# EAGLE design clock_v2 (EAGLE 5.12)
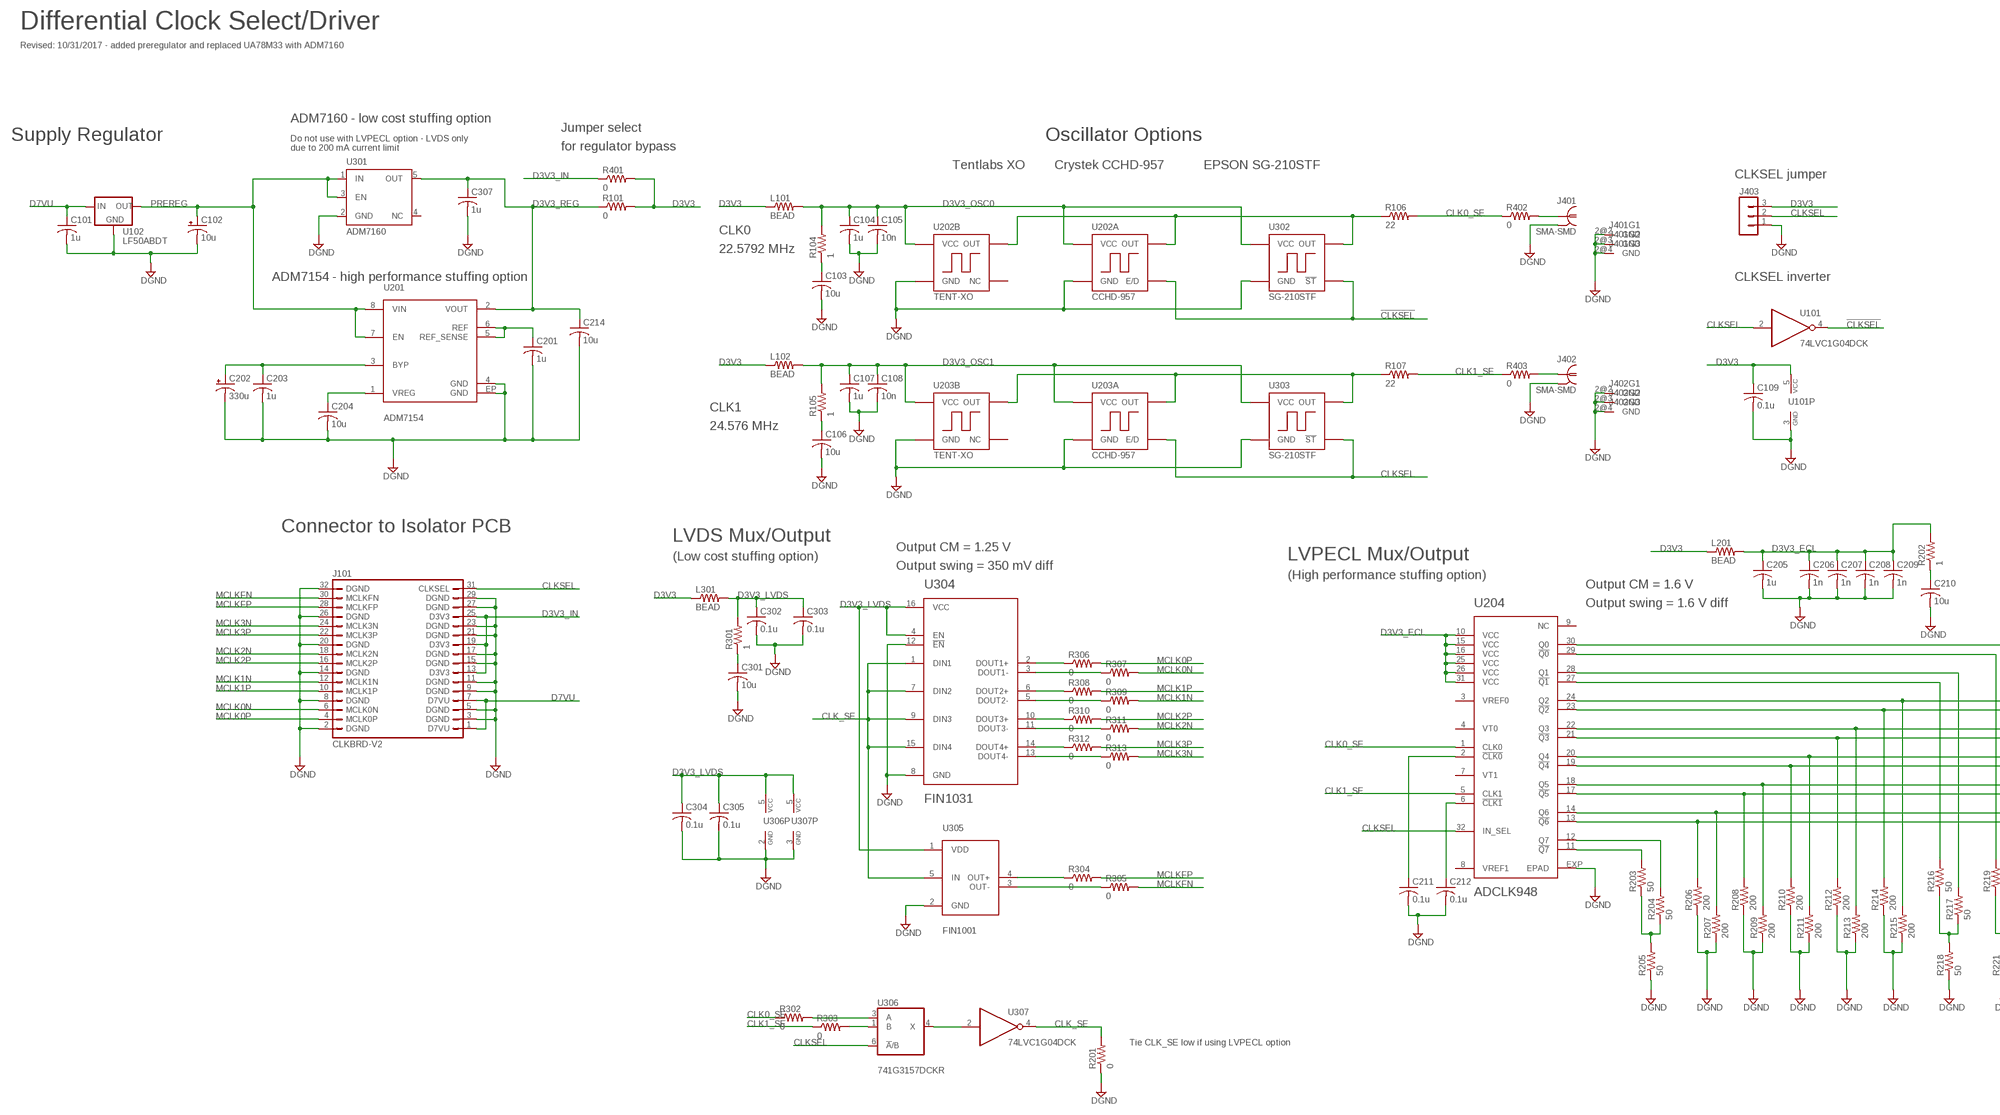
[diagram p0: schematic, sheet 1, part 1 of 2]
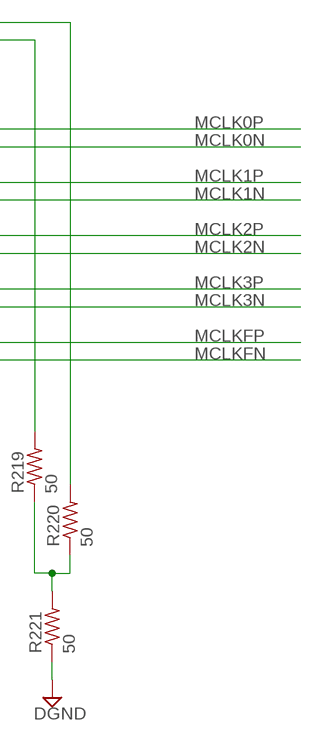
[diagram p1: schematic, sheet 1, part 2 of 2]

## Parts
C101  1u  C-USC0805  [C0805]
C102  10u  CPOL-USB  [PANASONIC_B]
C103  10u  C-USC1206  [C1206]
C104  1u  C-USC1206  [C1206]
C105  10n  C-USC0402  [C0402]
C106  10u  C-USC1206  [C1206]
C107  1u  C-USC1206  [C1206]
C108  10n  C-USC0402  [C0402]
C109  0.1u  C-USC0603  [C0603]
C201  1u  C-USC0805  [C0805]
C202  330u  CPOL-USCT7343  [CT7343]
C203  1u  C-USC0805  [C0805]
C204  10u  C-USC1206  [C1206]
C205  1u  C-USC1206  [C1206]
C206  1n  C-USC0402  [C0402]
C207  1n  C-USC0402  [C0402]
C208  1n  C-USC0402  [C0402]
C209  1n  C-USC0402  [C0402]
C210  10u  C-USC1206  [C1206]
C211  0.1u  C-USC0603  [C0603]
C212  0.1u  C-USC0603  [C0603]
C214  10u  C-USC1206  [C1206]
C301  10u  C-USC1206  [C1206]
C302  0.1u  C-USC0603  [C0603]
C303  0.1u  C-USC0603  [C0603]
C304  0.1u  C-USC0603  [C0603]
C305  0.1u  C-USC0603  [C0603]
C307  1u  C-USC0603  [C0603]
J101  CLKBRD-V2  [MA16-2]
J401  SMA-SMD  [SMA-SMD]
J402  SMA-SMD  [SMA-SMD]
J403  MA03-1  [MA03-1]
L101  BEAD  R-US_R1206  [R1206]
L102  BEAD  R-US_R1206  [R1206]
L201  BEAD  R-US_R1206  [R1206]
L301  BEAD  R-US_R1206  [R1206]
R101  0  R-US_R1206  [R1206]
R104  1  R-US_R1206  [R1206]
R105  1  R-US_R1206  [R1206]
R106  22  R-US_R0603  [R0603]
R107  22  R-US_R0603  [R0603]
R201  0  R-US_R0603  [R0603]
R202  1  R-US_R1206  [R1206]
R203  50  R-US_R0603  [R0603]
R204  50  R-US_R0603  [R0603]
R205  50  R-US_R0603  [R0603]
R206  200  R-US_R0603  [R0603]
R207  200  R-US_R0603  [R0603]
R208  200  R-US_R0603  [R0603]
R209  200  R-US_R0603  [R0603]
R210  200  R-US_R0603  [R0603]
R211  200  R-US_R0603  [R0603]
R212  200  R-US_R0603  [R0603]
R213  200  R-US_R0603  [R0603]
R214  200  R-US_R0603  [R0603]
R215  200  R-US_R0603  [R0603]
R216  50  R-US_R0603  [R0603]
R217  50  R-US_R0603  [R0603]
R218  50  R-US_R0603  [R0603]
R219  50  R-US_R0603  [R0603]
R220  50  R-US_R0603  [R0603]
R221  50  R-US_R0603  [R0603]
R301  1  R-US_R1206  [R1206]
R302  0  R-US_R0603  [R0603]
R303  0  R-US_R0603  [R0603]
R304  0  R-US_R0603  [R0603]
R305  0  R-US_R0603  [R0603]
R306  0  R-US_R0603  [R0603]
R307  0  R-US_R0603  [R0603]
R308  0  R-US_R0603  [R0603]
R309  0  R-US_R0603  [R0603]
R310  0  R-US_R0603  [R0603]
R311  0  R-US_R0603  [R0603]
R312  0  R-US_R0603  [R0603]
R313  0  R-US_R0603  [R0603]
R401  0  R-US_R1206  [R1206]
R402  0  R-US_R0603  [R0603]
R403  0  R-US_R0603  [R0603]
U101  74LVC1G04DCK  [SC70-5]
U102  LF50ABDT  78XXS  [DPACK]
U201  ADM7154  [SO8-EP]
U202A  CCHD-957  [CCHD-957]
U202B  TENT-XO  [DIP4-XO]
U203A  CCHD-957  [CCHD-957]
U203B  TENT-XO  [DIP4-XO]
U204  ADCLK948  [LFCSP32]
U301  ADM7160  [SOT23-DBV]
U302  SG-210STF  [SG-210STF]
U303  SG-210STF  [SG-210STF]
U304  FIN1031  [TSSOP16]
U305  FIN1001  [SOT23-DBV]
U306  741G3157DCKR  [DCK_R-PDSO-G6]
U307  74LVC1G04DCK  [SC70-5]

## Nets
!CLKSEL: U101.4(O) U202A.1(E/D) U302.1(!ST)
CLK0_SE: R106.2 R302.1 R402.1 U204.1(CLK0)
CLK1_SE: R107.2 R303.1 R403.1 U204.5(CLK1)
CLK_SE: R201.2 U304.1(DIN1) U304.7(DIN2) U304.9(DIN3) U304.15(DIN4) U305.5(IN) U307.4(O)
CLKSEL: J101.31(CLKSEL) J403.2 U101.2(I) U203A.1(E/D) U204.32(IN_SEL) U303.1(!ST) U306.6(!A!/B)
D3V3: C109.1 J403.3 L101.1 L102.1 L201.1 L301.1 R101.2 R401.2 U101.5(VCC)
D3V3_ECL: C205.1 C206.1 C207.1 C208.1 C209.1 L201.2 R202.2 U204.10(VCC) U204.15(VCC) U204.16(VCC) U204.25(VCC) U204.26(VCC) U204.31(VCC)
D3V3_IN: J101.13(D3V3) J101.19(D3V3) J101.25(D3V3) R401.1
D3V3_LVDS: C302.1 C303.1 C304.1 C305.1 L301.2 R301.2 U304.4(EN) U304.16(VCC) U305.1(VDD) U306.5(VCC) U307.5(VCC)
D3V3_OSC0: C104.1 C105.1 L101.2 R104.2 U202A.4(VCC) U202B.8(VCC) U302.4(VCC)
D3V3_OSC1: C107.1 C108.1 L102.2 R105.2 U203A.4(VCC) U203B.8(VCC) U303.4(VCC)
D3V3_REG: C214.1 C307.1 R101.1 U201.2(VOUT) U301.5(OUT)
D7VU: C101.1 J101.1(D7VU) J101.7(D7VU) U102.1(IN)
DGND: C101.2 C102.- C103.2 C104.2 C105.2 C106.2 C107.2 C108.2 C109.2 C201.2 C202.- C203.2 C204.2 C205.2 C206.2 C207.2 C208.2 C209.2 C210.2 C211.2 C212.2 C214.2 C301.2 C302.2 C303.2 C304.2 C305.2 C307.2 J101.2(DGND) J101.3(DGND) J101.5(DGND) J101.8(DGND) J101.9(DGND) J101.11(DGND) J101.14(DGND) J101.15(DGND) J101.17(DGND) J101.20(DGND) J101.21(DGND) J101.23(DGND) J101.26(DGND) J101.27(DGND) J101.29(DGND) J101.32(DGND) J401.2@1(GND) J401.2@2(GND) J401.2@3(GND) J401.2@4(GND) J402.2@1(GND) J402.2@2(GND) J402.2@3(GND) J402.2@4(GND) J403.1 R201.1 R205.1 R206.1 R207.1 R208.1 R209.1 R210.1 R211.1 R212.1 R213.1 R214.1 R215.1 R218.1 R221.1 U101.3(GND) U102.4(GND) U201.4(GND) U201.EP(GND) U202A.2(GND) U202B.4(GND) U203A.2(GND) U203B.4(GND) U204.EXP(EPAD) U301.2(GND) U302.2(GND) U303.2(GND) U304.8(GND) U304.12(!EN) U305.2(GND) U306.2(GND) U307.3(GND)
MCLK0N: J101.6(MCLK0N) R214.2 R307.2 U204.23(!Q2)
MCLK0P: J101.4(MCLK0P) R215.2 R306.2 U204.24(Q2)
MCLK1N: J101.12(MCLK1N) R212.2 R309.2 U204.21(!Q3)
MCLK1P: J101.10(MCLK1P) R213.2 R308.2 U204.22(Q3)
MCLK2N: J101.18(MCLK2N) R210.2 R311.2 U204.19(!Q4)
MCLK2P: J101.16(MCLK2P) R211.2 R310.2 U204.20(Q4)
MCLK3N: J101.24(MCLK3N) R208.2 R313.2 U204.17(!Q5)
MCLK3P: J101.22(MCLK3P) R209.2 R312.2 U204.18(Q5)
MCLKFN: J101.30(MCLKFN) R206.2 R305.2 U204.13(!Q6)
MCLKFP: J101.28(MCLKFP) R207.2 R304.2 U204.14(Q6)
N$1: C204.1 U201.1(VREG)
N$2: R106.1 U202A.3(OUT) U202B.5(OUT) U302.3(OUT)
N$3: C202.+ C203.1 U201.3(BYP)
N$4: C201.1 U201.5(REF_SENSE) U201.6(REF)
N$5: J401.1 R402.2
N$6: J402.1 R403.2
N$7: R107.1 U203A.3(OUT) U203B.5(OUT) U303.3(OUT)
N$8: R203.2 U204.11(!Q7)
N$9: C212.1 U204.6(!CLK1)
N$10: C211.1 U204.2(!CLK0)
N$11: R204.2 U204.12(Q7)
N$14: R306.1 U304.2(DOUT1+)
N$15: R302.2 U306.3(A)
N$16: R303.2 U306.1(B)
N$17: R307.1 U304.3(DOUT1-)
N$18: U306.4(X) U307.2(I)
N$19: C103.1 R104.1
N$20: R308.1 U304.6(DOUT2+)
N$21: R309.1 U304.5(DOUT2-)
N$22: R216.2 U204.27(!Q1)
N$23: R217.2 U204.28(Q1)
N$24: R219.2 U204.29(!Q0)
N$25: R220.2 U204.30(Q0)
N$26: R203.1 R204.1 R205.2
N$27: C106.1 R105.1
N$28: C301.1 R301.1
N$29: R216.1 R217.1 R218.2
N$30: R219.1 R220.1 R221.2
N$31: R310.1 U304.10(DOUT3+)
N$32: C210.1 R202.1
N$33: R311.1 U304.11(DOUT3-)
N$35: R312.1 U304.14(DOUT4+)
N$37: R313.1 U304.13(DOUT4-)
N$39: R304.1 U305.4(OUT+)
N$41: R305.1 U305.3(OUT-)
PREREG: C102.+ U102.3(OUT) U201.7(EN) U201.8(VIN) U301.1(IN) U301.3(EN)
Unconnected: U202B.1(NC) U203B.1(NC) U204.3(VREF0) U204.4(VT0) U204.7(VT1) U204.8(VREF1) U204.9(NC) U301.4(NC)

## Notes on the sheet
- Differential Clock Select/Driver
- Revised: 10/31/2017 - added preregulator and replaced UA78M33 with ADM7160
- ADM7160 - low cost stuffing option
- Jumper select
- Supply Regulator | Do not use with LVPECL option - LVDS only | Oscillator Options
- due to 200 mA current limit | for regulator bypass
- Tentlabs XO | Crystek CCHD-957 | EPSON SG-210STF
- CLKSEL jumper
- CLK0
- 22.5792 MHz
- ADM7154 - high performance stuffing option | CLKSEL inverter
- CLK1
- 24.576 MHz
- Connector to Isolator PCB
- LVDS Mux/Output
- Output CM = 1.25 V
- (Low cost stuffing option) | LVPECL Mux/Output
- Output swing = 350 mV diff
- (High performance stuffing option)
- Output CM = 1.6 V
- Output swing = 1.6 V diff
- Tie CLK_SE low if using LVPECL option

## Library data of the parts
C101 C103-C109 C201 C203-C212 C214 C301-C305 C307 = rcl:C-US: CAPACITOR, American symbol
C102 C202 = rcl:CPOL-US: POLARIZED CAPACITOR, American symbol
J101 = cdp:CLKBRD-V2
J401 J402 = cdp:SMA-SMD: SMA 50 Ohm Straight Jack Receptacle - Surface Mount www.johnsoncomponents.com Source: http://catalog.digikey.com .. 142-0711-201, 205, 202, 206.pdf; OC_FARNELL: unknown; OC_NEWARK: unknown
J403 = con-lstb:MA03-1: PIN HEADER; OC_FARNELL: unknown; OC_NEWARK: unknown
L101 L102 L201 L301 R101 R104-R107 R201-R221 R301-R313 R401-R403 = rcl:R-US_: RESISTOR, American symbol
U101 U307 = 74xx-little-us:74*1G04: INVERTER Gate
U102 = cdp:78XXS: VOLTAGE REGULATOR
U201 = cdp:ADM7154
U202A U203A = cdp:CCHD-957
U202B U203B = cdp:TENT-XO
U204 = cdp:ADCLK948
U301 = cdp:ADM7160
U302 U303 = cdp:SG-210STF
U304 = cdp:FIN1031
U305 = cdp:FIN1001
U306 = 74xx-little-us:74*1G3157: Single-Pole, Double-Throw Analog Switch Source: http://focus.ti.com/lit/ds/symlink/sn74lvc1g3157.pdf

## Board
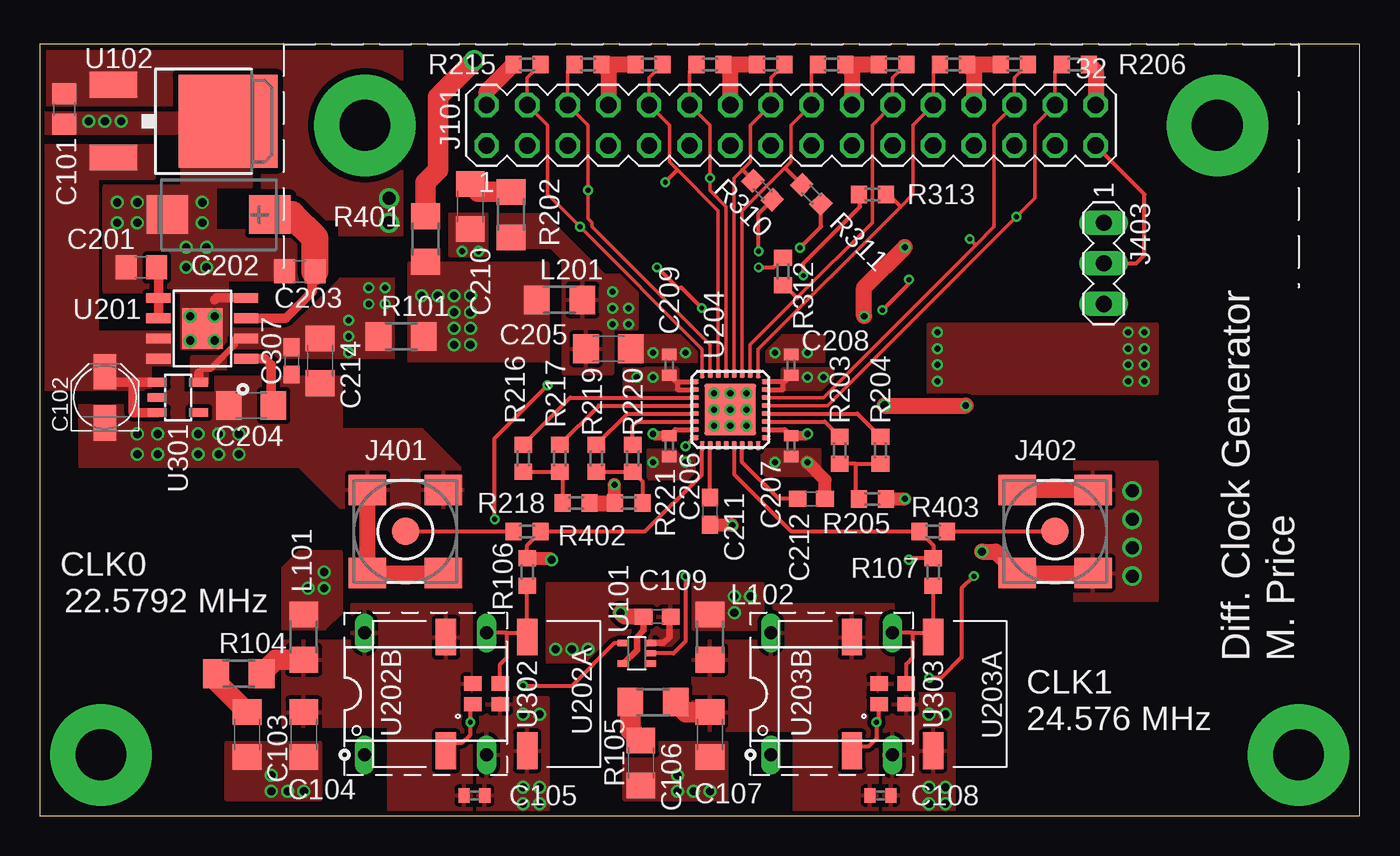
[diagram p2: board, top side]
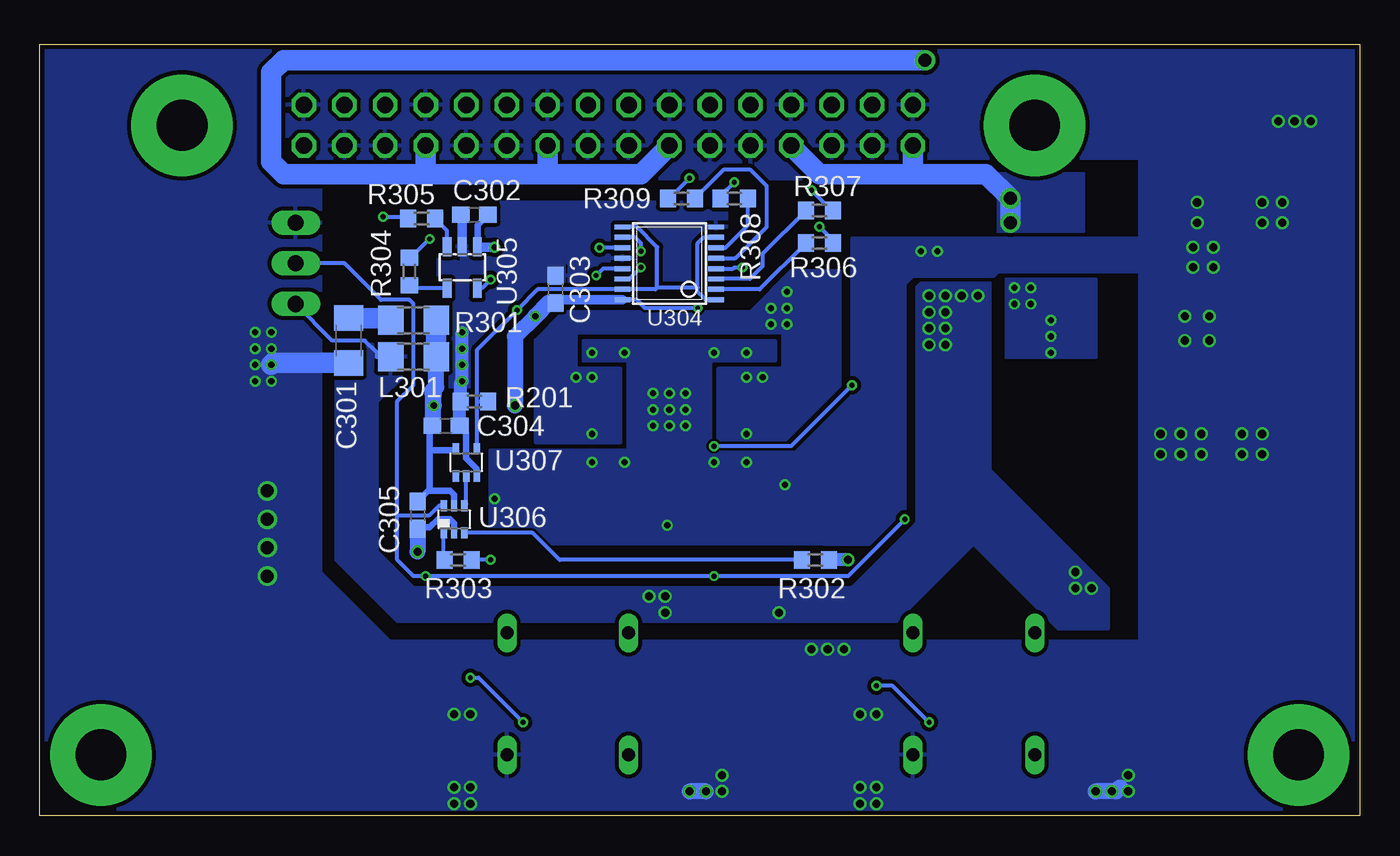
[diagram p3: board, bottom side, seen from below]

Size 82.55 x 48.26 mm. Coordinates in mm from the lower left corner, seen from the top.
Outline: 0,0 82.55,0 82.55,48.26 0,48.26 0,0
Copper layers (1*16): Top 0.035mm / dielectric 1.6mm / Bottom 0.035mm
Design rules "Elecrow_2-layer_PCB_eagle_rule_mod": minimum track width 6mil, minimum drill 12mil, track to track 6mil, track to pad 6mil, pad to pad 6mil, via to via 8mil, smd to smd 0mil, copper to edge 12mil, drill to drill 10mil, minimum pad ring 6mil, minimum via ring 6mil, stop-mask expansion 0mil, vias tented up to drill 100mil, thermal gap 10mil

### Footprints (pad centres in the part's own frame; a part is rotated, then mirrored left to right if it is on the bottom)
C0805 = smd 1.3 x 1.5: 1 -0.95,0; 2 0.95,0
PANASONIC_B = smd 2.2 x 1.4: + 1.6,0; - -1.6,0
C1206 = smd 1.6 x 1.8: 1 -1.4,0; 2 1.4,0
C0402 = smd 0.7 x 0.9: 1 -0.65,0; 2 0.65,0
C0603 = smd 1.1 x 1: 1 -0.85,0; 2 0.85,0
CT7343 = smd 2.6 x 2.4: + -3.2,0; - 3.2,0
MA16-2 = drill 1.016 octagon: 1 -20.32,-1.27; 2 -20.32,1.27; 3 -17.78,-1.27; 4 -17.78,1.27; 5 -15.24,-1.27; 6 -15.24,1.27; 7 -12.7,-1.27; 8 -12.7,1.27; 9 -10.16,-1.27; 10 -10.16,1.27; 11 -7.62,-1.27; 12 -7.62,1.27; 13 -5.08,-1.27; 14 -5.08,1.27; 15 -2.54,-1.27; 16 -2.54,1.27; 17 0,-1.27; 18 0,1.27; 19 2.54,-1.27; 20 2.54,1.27; 21 5.08,-1.27; 22 5.08,1.27; 23 7.62,-1.27; 24 7.62,1.27; 25 10.16,-1.27; 26 10.16,1.27; 27 12.7,-1.27; 28 12.7,1.27; 29 15.24,-1.27; 30 15.24,1.27; 31 17.78,-1.27; 32 17.78,1.27 | drill 3.175 pad 6.35 round: P$1 25.4,0; P$2 -27.94,0
SMA-SMD = smd 1.73 x 1.73: 1 0,0 | smd 2.35 x 1.9: 2@1 -2.375,2.6; 2@2 -2.375,-2.6; 2@3 2.375,-2.6; 2@4 2.375,2.6
MA03-1 = drill 1.016 long: 1 -2.54,0; 2 0,0; 3 2.54,0
R1206 = smd 1.6 x 1.803: 1 -1.422,0; 2 1.422,0
R0603 = smd 1 x 1.1: 1 -0.85,0; 2 0.85,0
SC70-5 = smd 0.4 x 0.7: 1 -0.65,-0.85; 2 0,-0.85; 3 0.65,-0.85; 4 0.65,0.85; 5 -0.65,0.85
DPACK = smd 1.6 x 3: 1 -2.28,-4.8; 3 2.28,-4.8 | smd 5.8 x 6.2: 4 0,2.38
SO8-EP = smd 0.61 x 1.524: 1 -1.905,-2.743; 2 -0.635,-2.743; 3 0.635,-2.743; 4 1.905,-2.743; 5 1.905,2.743; 6 0.635,2.743; 7 -0.635,2.743; 8 -1.905,2.743 | smd 2.54 x 2.54: EP 0,0
CCHD-957 = smd 1.27 x 2.286: 1 -2.54,-3.556; 2 2.54,-3.556; 3 2.54,3.556; 4 -2.54,3.556
DIP4-XO = drill 0.813 long: 1 -3.81,-3.81; 4 3.81,-3.81; 5 3.81,3.81; 8 -3.81,3.81
LFCSP32 = smd 0.55 x 0.3: 1 -2.25,1.75; 2 -2.25,1.25; 3 -2.25,0.75; 4 -2.25,0.25; 5 -2.25,-0.25; 6 -2.25,-0.75; 7 -2.25,-1.25; 8 -2.25,-1.75; 17 2.25,-1.75; 18 2.25,-1.25; 19 2.25,-0.75; 20 2.25,-0.25; 21 2.25,0.25; 22 2.25,0.75; 23 2.25,1.25; 24 2.25,1.75 | smd 0.3 x 0.55: 9 -1.75,-2.25; 10 -1.25,-2.25; 11 -0.75,-2.25; 12 -0.25,-2.25; 13 0.25,-2.25; 14 0.75,-2.25; 15 1.25,-2.25; 16 1.75,-2.25; 25 1.75,2.25; 26 1.25,2.25; 27 0.75,2.25; 28 0.25,2.25; 29 -0.25,2.25; 30 -0.75,2.25; 31 -1.25,2.25; 32 -1.75,2.25 | smd 3.25 x 3.25: EXP 0,0
SOT23-DBV = smd 0.55 x 1.2: 1 -0.95,-1.3; 2 0,-1.3; 3 0.95,-1.3; 4 0.95,1.3; 5 -0.95,1.3
SG-210STF = smd 1.1 x 0.9: 1 -0.85,-0.65; 2 0.85,-0.65; 3 0.85,0.65; 4 -0.85,0.65
TSSOP16 = smd 0.305 x 0.991: 1 -2.275,-2.918; 2 -1.625,-2.918; 3 -0.975,-2.918; 4 -0.325,-2.918; 5 0.325,-2.918; 6 0.975,-2.918; 7 1.625,-2.918; 8 2.275,-2.918; 9 2.275,2.918; 10 1.625,2.918; 11 0.975,2.918; 12 0.325,2.918; 13 -0.325,2.918; 14 -0.975,2.918; 15 -1.625,2.918; 16 -2.275,2.918
DCK_R-PDSO-G6 = smd 0.4 x 0.7: 1 -0.65,-0.85; 2 0,-0.85; 3 0.65,-0.85; 4 0.65,0.85; 5 0,0.85; 6 -0.65,0.85

### Placement (x,y rotation side)
C101  1.52,44.2 270 top
C102  4.06,26.16 90 top
C103  12.95,5.08 270 top
C104  16.51,5.08 270 top
C105  27.18,1.27 0 top
C106  37.59,3.3 270 top
C107  41.91,5.08 270 top
C108  52.58,1.27 0 top
C109  38.61,12.45 0 top
C201  6.35,34.29 180 top
C202  11.18,37.59 180 top
C203  16.26,34.04 180 top
C204  13.21,25.65 180 top
C205  35.56,29.21 0 top
C206  39.37,23.11 270 top
C207  46.99,23.11 270 top
C208  46.99,28.19 90 top
C209  39.37,28.19 90 top
C210  26.92,38.1 270 top
C211  41.91,19.05 270 top
C212  48.26,19.81 0 top
C214  17.53,28.45 270 top
C301  63.25,29.72 270 bottom
C302  55.37,37.59 180 bottom
C303  50.29,32.92 90 bottom
C304  57.15,24.38 0 bottom
C305  58.93,18.8 270 bottom
C307  15.75,28.45 270 top
J101  48.26,43.18 0 top
J401  22.86,17.78 0 top
J402  63.5,17.78 0 top
J403  66.55,34.54 270 top
L101  16.51,11.18 270 top
L102  41.91,11.18 270 top
L201  32.51,32.26 0 top
L301  59.18,28.7 0 bottom
R101  22.61,29.97 0 top
R104  12.45,8.89 0 top
R105  38.35,7.11 0 top
R106  30.48,15.24 90 top
R107  55.88,15.24 90 top
R201  55.37,25.91 0 bottom
R202  29.46,37.59 270 top
R203  50.04,22.86 90 top
R204  52.58,22.86 90 top
R205  52.07,19.81 180 top
R206  64.77,46.99 180 top
R207  60.96,46.99 0 top
R208  57.15,46.99 180 top
R209  53.34,46.99 0 top
R210  49.53,46.99 180 top
R211  45.72,46.99 0 top
R212  41.91,46.99 180 top
R213  38.1,46.99 0 top
R214  34.29,46.99 180 top
R215  30.48,46.99 0 top
R216  30.23,22.35 90 top
R217  32.51,22.35 90 top
R218  33.53,19.56 180 top
R219  34.8,22.35 90 top
R220  37.08,22.35 90 top
R221  36.83,19.56 0 top
R301  59.18,30.99 0 bottom
R302  34.04,16 180 bottom
R303  56.39,16 180 bottom
R304  59.44,34.04 90 bottom
R305  58.67,37.34 180 bottom
R306  33.78,35.81 0 bottom
R307  33.78,37.85 0 bottom
R308  39.12,38.61 180 bottom
R309  42.42,38.61 180 bottom
R310  45.21,39.12 135 top
R311  48.26,38.86 135 top
R312  46.48,34.04 270 top
R313  52.07,38.86 0 top
R401  24.13,36.07 270 top
R402  30.48,17.78 180 top
R403  55.88,17.78 0 top
U101  37.34,10.16 90 top
U102  9.4,43.43 270 top
U201  10.16,30.48 90 top
U202A  27.94,7.62 0 top
U202B  24.13,7.62 0 top
U203A  53.34,7.62 0 top
U203B  49.53,7.62 0 top
U204  43.18,25.4 90 top
U301  8.64,26.16 270 top
U302  27.94,7.62 0 top
U303  53.34,7.62 0 top
U304  43.18,34.54 90 bottom
U305  56.13,34.29 180 bottom
U306  56.64,18.54 0 bottom
U307  55.88,22.1 0 bottom

### Tracks (layer width: path | path; a pad name or v marks a point on that pad's centre or on a via)
!CLKSEL  (via drill 0.3 pad 0.51)
  Top 0.254: U101.4 35.96,10.81 33.27,8.13 v30.23,8.13 | U302.1 26.92,6.8 v26.92,5.84 26.92,5.08 26.42,4.57 25.4,4.57 U202A.1
  Bottom 0.254: v30.23,8.13 29.21,8.13 v26.92,5.84
CLK0_SE  (via drill 0.51 pad 0.81)
  Top 0.254: R106.2 30.48,16.93 R402.1 37.85,17.78 41.4,21.34 41.4,23.12 U204.1
  Top 0.813: R106.2 31.92,16.09 v32,16
  Bottom 0.813: v32,16 R302.1
CLK1_SE  (via drill 0.3 pad 0.51)
  Top 0.254: U204.5 43.43,21.34 46.99,17.78 R403.1 55.88,16.93 R107.2 54.44,16.09 v54.36,16
  Bottom 0.254: v54.36,16 R303.1
CLK_SE  (via drill 0.3 pad 0.51)
  Top 0.254: v54.36,33.53 54.36,33.27 v52.7,31.62
  Bottom 0.254: 43.94,33.02 43.94,35.56 45.2,36.82 U304.9 | 43.94,33.02 44.04,32.92 U304.15 51.41,32.92 v52.7,31.62 55.23,29.1 55.23,25.91 | U304.7 41.05,36.17 41.4,35.81 41.4,33.02 | 41.4,33.02 43.94,33.02 | 55.23,25.91 U307.4 | 40.66,32.26 40.65,32.27 | 40.66,32.26 40.89,32.26 41.4,32.77 41.4,33.02 | 55.23,25.91 R201.2 | 40.66,32.26 40.27,32.26 U304.1 | U305.5 54.89,32.99 v54.36,33.53
CLKSEL  (via drill 0.3 pad 0.51)
  Top 0.254: U204.32 v40.39,23.11 | v58.42,14.99 57.66,14.22 57.66,9.91 56.39,8.64 v55.63,8.64 | U303.1 52.49,6.01 v52.32,5.84 52.32,4.83 51.82,4.32 51.05,4.32 U203A.1 | v40.39,14.99 40.39,10.92 39.62,10.16 U101.2 | v28.45,18.54 28.45,23.62 v31.75,26.92 | J101.31 69.09,38.86 69.09,35.05 68.58,34.54 J403.2
  Bottom 0.254: v40.39,23.11 35.56,23.11 v31.75,26.92 | 60.2,18.8 60.2,16 59.18,14.99 v58.42,14.99 v40.39,14.99 32,14.99 v28.45,18.54 | 60.2,18.8 60.2,25.91 59.18,26.92 59.18,32 59.44,32.26 61.21,32.26 63.5,34.54 J403.2 | v55.63,8.64 55.12,8.64 v52.32,5.84 | U306.6 57.57,19.39 58.17,18.8 60.2,18.8
D3V3  (via drill 0.51 pad 0.81)
  Top 0.406: U101.5 37.34,10.36 37.34,11.18 37.76,11.6 C109.1
  Top 0.813: L101.1 16.76,12.85
  Top 1.016: C109.1 36.58,12.45 v36.32,12.7
  Top 1.27: R401.2 24.03,34.54
  Bottom 0.254: L301.1 61.47,28.7 61.47,28.96 62.23,29.72 64.26,29.72 J403.3
  other vias: 23.88,32.51 24.89,32.51 25.91,32.51 26.92,32.51 25.91,31.5 26.92,31.5 26.92,30.48 25.91,30.48 25.91,29.46 26.92,29.46 16.76,14.22 17.78,14.22 17.78,15.24 43.43,13.72 44.45,13.72 43.43,12.7
  pour Top (isolate 0.254, no thermals): 23.11,28.45 23.11,34.54 31.75,34.54 31.75,28.45
  pour Bottom (isolate 0.254): 23.11,33.27 27.43,33.27 27.69,33.02 27.69,18.29 31.75,14.22 59.18,14.22 61.47,16.51 61.47,25.91 59.69,27.69 59.69,29.46 61.98,29.46 64.01,27.43 64.01,16 60.2,12.19 28.96,12.19 23.11,18.03
  pour Bottom (isolate 0.254): 15.75,11.68 18.8,11.68 24.13,17.02 24.38,22.86 15.75,14.22
  pour Top (isolate 0.254, no thermals): 15.24,11.68 15.24,15.49 16.26,16.51 18.8,16.51 18.8,12.7 17.78,11.68
  pour Top (isolate 0.254, no thermals): 40.89,14.48 40.89,11.68 45.21,11.68 45.21,14.48
D3V3_ECL  (via drill 0.38 pad 0.64)
  Top 0.305: U204.10 46.6,24.15 C207.1 | U204.31 39.76,24.15 C206.1 | 39.88,27.15 39.76,27.15 C209.1 | 39.88,27.15 U204.25 | 46.48,27.15 U204.16 | 46.48,27.15 46.6,27.15 C208.1 | U204.15 46.48,26.65 46.48,27.15 | U204.26 39.88,26.65 39.88,27.15
  Top 0.61: C207.1 47.89,23.76 v48.01,23.88 | C206.1 38.47,23.76 v38.35,23.88
  other vias: 48.01,27.43 49.02,27.43 38.35,27.43 37.34,27.43 35.81,32.77 35.81,31.75 36.83,31.75 35.81,30.73 36.83,30.73
  pour Bottom: 36.07,27.94 40.13,27.94 40.13,23.37 36.07,23.37 32.51,26.92 32.51,34.04 35.56,34.04 38.1,31.5 49.78,31.5 51.56,29.72 51.56,23.37 46.23,23.37 46.23,27.94 49.02,27.94 49.02,30.23 36.07,30.23
  pour Top: 35.81,28.45 35.81,30.48 37.34,30.48 37.34,33.78 32.77,33.78 32.77,27.69 35.81,27.69
  pour Top (isolate 0.254, no thermals): 39.88,26.67 39.88,27.94 36.58,27.94 36.58,26.67
  pour Top (isolate 0.254, no thermals): 46.48,27.94 49.53,27.94 49.53,26.67 46.48,26.67
  pour Top (isolate 0.254, no thermals): 31.5,37.59 35.31,33.78 32.77,33.78 32.77,34.8 32,35.56 28.7,35.56 28.7,37.59
D3V3_IN  (via drill 0.81 pad 1.27)
  Top 1.27: v27.18,47.24 24.89,44.96 24.89,40.39 24.13,39.62 R401.1
  Bottom 0.254: 58.17,40.13 58.42,40.39
  Bottom 1.27: J101.13 44.96,40.13 51.05,40.13 | J101.19 50.8,40.39 51.05,40.13 | 51.05,40.13 58.17,40.13 67.31,40.13 68.07,40.89 68.07,46.48 67.31,47.24 v27.18,47.24 | 58.42,40.39 J101.25
D3V3_LVDS  (via drill 0.3 pad 0.51, 0.38 pad 0.64, 0.51 pad 0.81)
  Top 0.254: v41.4,31.75 40.13,33.02 39.88,33.02 v38.61,34.29
  Top 1.016: v51.56,31.24 51.56,33.02 v54.1,35.56 | v52.83,25.65 v57.91,25.65
  Bottom 0.254: U304.4 39.19,34.22 39.12,34.29 v38.61,34.29 | v41.4,31.75 44.7,31.75 45.21,32.26 46.09,32.26 U304.16 | 50.07,32.27 50.27,32.07 C303.1 50.74,32.07
  Bottom 0.406: C305.1 58.25,20.32 58.17,20.32 | 58.17,20.32 56.9,20.32 56.64,20.07 U306.5 | C304.1 58.17,24.22 58.17,22.86 | 58.17,22.86 58.17,20.32 | U307.5 56.62,22.86 58.17,22.86 | U305.1 55.18,36.93 C302.1
  Bottom 0.61: U304.16 50.07,32.27 | v54.1,35.56 54.9,35.56 U305.1
  Bottom 1.016: 58,26.42 C304.1 | 58,26.42 58,26.58 57.76,26.82 L301.2 | 50.74,32.07 v51.56,31.24 52.83,29.97 v52.83,25.65 | v57.91,25.65 57.91,26.33 58,26.42
  Bottom 1.27: L301.2 R301.2
D3V3_OSC0
  Top 1.27: L101.2 14.73,9.75 R104.2
  pour Top (isolate 0.254): 15.24,10.92 19.56,10.92 19.56,13.21 26.92,13.21 26.92,0.25 21.84,0.25 21.84,5.59 15.24,5.59
D3V3_OSC1
  Top 1.27: C107.1 40.41,6.48 R105.2
  pour Top (isolate 0.254): 40.89,10.92 45.72,10.92 45.97,10.92 45.97,13.21 53.34,13.21 53.34,8.13 52.32,8.13 52.32,0.25 47.24,0.25 47.24,5.33 40.89,5.33
D3V3_REG  (via drill 0.38 pad 0.64)
  Top 0.406: U201.2 12.19,29.84 12.19,29.46 10.67,27.94 10.19,27.94 9.94,27.69
  Top 0.61: U301.5 9.94,27.69
  other vias: 20.57,33.02 21.59,33.02 21.59,32 20.57,32 19.3,30.99 19.3,29.97 19.3,28.96
  pour Top (isolate 0.254, no thermals): 12.19,31.24 12.19,28.7 22.1,28.7 22.1,33.53 18.8,33.53 16.51,31.24
  pour Bottom (isolate 0.254): 17.78,33.53 22.1,33.53 22.1,28.7 16.51,28.7 16.51,33.53
  pour Top (isolate 0.254, no thermals): 9.53,27.05 9.53,28.7 11.56,28.7 11.56,27.94 10.41,27.94 10.41,27.05
D7VU  (via drill 0.81 pad 1.27)
  Bottom 1.27: J101.7 33.78,40.13 28.19,40.13 | 28.19,40.13 23.37,40.13 v21.84,38.61 v21.84,37.08 | J101.1 27.94,40.39 28.19,40.13
  pour Top (isolate 0.381, no thermals): 13.97,44.45 0,44.45 0,48.26 22.61,48.26 22.61,36.32 18.8,36.32 18.8,37.34 13.97,37.34
  pour Bottom (isolate 0.254): 17.27,40.13 22.61,40.13 22.61,36.58 17.27,36.58
DGND  (via drill 0.38 pad 0.64, 0.51 pad 0.51, 0.51 pad 0.81, 0.81 pad 0.64)
  Top 0.406: U101.3 39,10.81 39.37,11.18 39.37,12.36 C109.2
  Top 0.61: U201.4 11.05,32.38 10.92,32.26
  Top 0.813: v35.94,20.7 35.94,19.6 R221.1 | v48.01,22.1 49.11,20.99 C212.2 49.11,19.72 | C211.2 43.27,18.2 v43.31,18.16 | R205.1 v54.1,19.81
  Top 1.016: J101.2 27.94,45.3 R215.1 | J101.8 35.56,46.57 R214.1 R213.1 | R212.1 43.43,46.99 | 43.43,46.99 R211.1 | J101.14 43.18,46.74 43.43,46.99 | R209.1 R210.1 50.8,46.57 J101.20 | R207.1 R208.1 58.42,46.57 J101.26 | J101.32 66.04,46.57 R206.1 | R218.1 R221.1 | J401.2@1 J401.2@2 J401.2@3 | J402.2@1 J402.2@4 | J402.2@3 J402.2@2 59.8,16.51 v58.93,16.51
  Bottom 0.406: U307.3 55.23,21.7 55.88,22.35 55.88,23.96 C304.2 | U306.2 56.64,18.29 56.9,18.54 57.66,18.54 58.17,18.03 58.84,18.03 C305.2 | C302.2 56.13,37.5
  Bottom 0.61: 56.13,37.5 U305.2
  Bottom 0.813: C304.2 56.3,25.83 R201.1 56.22,27.09 v56.13,27.18 v56.13,28.19 v56.13,29.21 v56.13,30.23
  Bottom 1.016: C303.2 50.31,33.78 | v40.89,1.52 v41.91,1.52 | v16.51,1.52 15.24,1.52 14.99,1.78 | C305.2 v58.93,16.51
  Bottom 1.27: C301.2 67.95,28.32 v68.07,28.19
  other vias: 38.35,28.96 40.39,28.96 45.97,28.96 48.01,28.96 38.35,22.1 40.39,22.1 45.97,22.1 42.16,26.42 44.2,26.42 44.2,24.38 42.16,24.38 42.16,25.4 43.18,25.4 43.18,26.42 44.2,25.4 43.18,24.38 9.4,31.24 10.92,31.24 9.4,29.72 10.92,29.72 9.91,23.88 11.18,23.88 12.45,23.88 9.91,22.61 11.18,22.61 12.45,22.61 9.14,35.56 10.41,35.56 9.14,34.29 10.41,34.29 10.16,38.35 6.1,37.08 6.1,38.35 4.83,38.35 4.83,37.08 68.33,20.32 68.33,18.54 68.33,16.76 68.33,14.99 30.23,1.78 31.24,1.78 30.23,6.35 31.24,6.35 30.23,0.76 31.24,0.76 56.64,6.35 55.63,6.35 56.64,0.76 55.63,0.76 55.63,1.78 56.64,1.78 15.49,1.52 14.48,1.52 14.48,2.54 39.88,1.52 39.88,2.54 34.29,10.41 33.27,10.41 32.26,10.41 68.07,30.23 69.09,30.23 69.09,29.21 69.09,28.19 69.09,27.18 68.07,27.18 68.07,29.21 27.43,35.31 26.42,35.31 10.16,37.08 3.05,43.43 4.06,43.43 5.08,43.43 7.37,23.88 6.1,23.88 6.1,22.61 7.37,22.61
  pour Bottom: 36.58,29.72 36.58,28.45 40.64,28.45 40.64,22.86 35.56,22.86 33.53,20.83 33.53,17.02 54.36,17.02 54.36,22.86 45.72,22.86 45.72,28.45 48.51,28.45 48.51,29.72
  pour Top (no thermals): 37.08,28.45 41.4,28.45 41.4,29.97 38.1,29.97 37.08,29.97
  pour Top (isolate 0.254, no thermals): 45.47,28.45 49.02,28.45 49.02,29.97 45.47,29.97
  pour Top (isolate 0.254, no thermals): 48.77,22.86 45.21,22.86 45.21,21.34 48.77,21.34
  pour Top (isolate 0.254, no thermals): 38.1,22.86 40.89,22.86 40.89,21.08 38.1,21.08
  pour Bottom (isolate 0.254): 26.67,48.26 67.31,48.26 67.31,39.88 26.67,39.88
  pour Top (isolate 0.254): 52.83,7.62 57.15,7.62 57.15,0.25 52.83,0.25
  pour Top (isolate 0.254): 27.43,7.37 31.75,7.37 31.75,0.25 27.43,0.25
  pour Top (isolate 0.254, no thermals): 4.06,39.37 10.92,39.37 10.92,36.58 16.26,36.58 16.26,33.53 11.68,33.53 11.68,29.21 8.89,29.21 8.89,32.77 4.06,32.77
  pour Top (isolate 0.254, no thermals): 7.87,27.43 8.89,27.43 8.89,26.42 11.05,26.42 11.05,27.43 18.8,27.43 18.8,21.84 7.87,21.84
  pour Bottom (isolate 0.254): 13.72,48.26 0,48.26 0,0 82.8,0 82.8,48.26 65.02,48.26 65.02,23.88 65.02,15.24 60.71,10.92 13.72,10.92
  pour Bottom (isolate 0.254): 11.94,48.26 27.43,48.26 27.43,41.15 11.94,41.15
  pour Bottom (isolate 0.254, no thermals): 13.21,36.07 31.75,36.07 31.75,26.42 36.32,21.84 36.32,19.81 33.53,17.02 29.97,17.02 28.45,18.54 28.45,33.27 27.94,33.78 22.86,33.78 22.61,34.04 13.21,34.04
  pour Top (isolate 0.254): 17.27,24.13 23.88,24.13 26.42,21.59 26.42,19.3 18.8,19.3 16.26,21.84 16.26,23.11
  pour Top (isolate 0.254): 64.77,22.1 69.85,22.1 69.85,13.46 64.77,13.46
  pour Top (isolate 0.254, no thermals): 11.68,4.57 17.53,4.57 17.53,1.02 11.68,1.02
  pour Top (isolate 0.254, no thermals): 36.58,4.57 42.93,4.57 42.93,1.02 36.58,1.02
  pour Top (isolate 0.254): 31.75,9.65 40.39,9.65 40.39,14.48 31.75,14.48
  pour Bottom (isolate 0.254): 39.62,33.27 54.86,33.27 54.86,38.35 39.62,38.35
  pour Top (isolate 0.254): 55.63,30.73 69.85,30.73 69.85,26.42 55.63,26.42
  pour Bottom (isolate 0.254): 55.63,26.42 55.63,36.32 57.66,36.32 57.66,26.42
  pour Bottom (isolate 0.254, no thermals): 49.78,32.77 56.13,29.21 56.13,35.31 49.78,35.31
  pour Top (isolate 0.254, no thermals): 25.65,35.05 27.94,35.05 27.94,37.59 25.65,37.59
  pour Top (isolate 0.254, no thermals): 8.89,43.94 8.89,39.37 13.21,39.37 13.21,43.94
  pour Top (isolate 0.254, no thermals): 0.25,43.94 9.65,43.94 9.65,42.67 0.25,42.67
  pour Top (isolate 0.254, no thermals): 2.54,25.65 8.89,25.65 8.89,21.84 2.54,21.84
MCLK0N  (via drill 0.3 pad 0.51)
  Top 0.229: U204.23 41.93,29.44 34.54,36.83 34.54,37.08 34.29,37.34 v34.29,39.12 34.29,43.18 J101.6 33.02,46.57 R214.2
  Bottom 0.254: R307.2 33.02,37.85 v34.29,39.12
MCLK0P  (via drill 0.3 pad 0.51)
  Top 0.229: U204.24 41.43,29.18 v33.78,36.83 31.75,38.86 31.75,43.18 J101.4 30.48,46.14 R215.2
  Bottom 0.254: R306.2 32.93,35.98 v33.78,36.83
MCLK1N  (via drill 0.3 pad 0.51)
  Top 0.229: U204.21 42.93,38.1 41.91,39.12 v41.91,39.88 41.91,43.18 J101.12 40.64,46.57 R212.2
  Bottom 0.254: R309.2 43.18,38.61 v41.91,39.88
MCLK1P  (via drill 0.3 pad 0.51)
  Top 0.229: U204.22 42.43,37.83 39.88,40.39 39.37,40.89 39.37,43.18 J101.10 38.1,46.14 R213.2
  Top 0.254: 39.88,40.39 v39.12,39.62
  Bottom 0.254: R308.2 39.97,38.77 v39.12,39.62
MCLK2N
  Top 0.229: U204.19 43.93,37.83 46.61,40.51 46.99,40.89 46.99,43.18 J101.18 48.26,46.57 R210.2
  Top 0.254: R311.2 | 46.61,40.51 R311.2
MCLK2P
  Top 0.229: U204.20 43.43,39.87 43.94,40.39 44.45,40.89 44.45,43.18 J101.16 45.72,46.14 R211.2
  Top 0.254: R310.2 | 43.94,40.39 R310.2
MCLK3N
  Top 0.229: U204.17 44.93,29.18 53.85,38.1 54.61,38.86 54.61,43.18 J101.24 55.88,46.57 R208.2
  Top 0.254: R313.2 53.09,38.86 53.85,38.1
MCLK3P
  Top 0.229: U204.18 44.43,29.44 47.37,32.38 52.07,37.08 52.07,43.18 J101.22 53.34,46.14 R209.2
  Top 0.254: R312.2 46.57,33.19 47.37,32.38
MCLKFN  (via drill 0.3 pad 0.51)
  Top 0.229: U204.13 49.27,25.65 60.96,37.34 | v61.09,37.47 62.23,38.61 62.23,43.18 J101.30 63.5,46.57 R206.2
  Top 0.254: 60.96,37.34 v61.09,37.47
  Bottom 0.254: R305.2 59.4,37.47 v61.09,37.47
MCLKFP  (via drill 0.3 pad 0.51)
  Top 0.229: U204.14 49.01,26.15 58.55,35.69 59.69,36.83 59.69,43.18 J101.28 60.96,46.14 R207.2
  Top 0.254: 58.55,35.69 v58.17,36.07
  Bottom 0.254: R304.2 59.35,34.89 v58.17,36.07
N$1
  Top 0.61: U201.1 14.1,28.57 14.48,28.19 14.48,25.78 C204.1
N$2
  Top 0.254: R106.1 U202A.3 30.23,11.43 29.21,11.43 | 29.21,11.43 U202B.5 | U302.3 28.79,9.49 29.21,9.91 29.21,11.43
N$3
  Top 0.61: U201.3 15.37,31.11 17.02,32.77 17.02,34.61 C203.1
  Top 1.27: 15.75,37.59 C202.+
  Top 1.676: 15.75,37.59 17.21,36.13 C203.1
N$4
  Top 0.61: U201.6 U201.5 7.42,34.68 C201.1
N$5
  Top 0.254: J401.1 R402.2
N$6
  Top 0.254: R403.2 J402.1
N$7
  Top 0.254: 55.88,11.68 U203A.3 | 55.88,11.68 R107.1 | 54.61,11.43 U203B.5 | 54.61,11.43 55.63,11.43 55.88,11.68 | U303.3 54.19,9.49 54.61,9.91 54.61,11.43
N$8
  Top 0.254: U204.11 49.1,24.65 R203.2
N$9
  Top 0.254: U204.6 43.93,22.11 46.23,19.81 C212.1
N$10
  Top 0.254: U204.2 41.93,19.92 C211.1
N$11
  Top 0.254: U204.12 51.14,25.15 R204.2
N$12  (via drill 3.17 pad 6.35)
  other vias: 3.81,3.81
N$13  (via drill 3.17 pad 6.35)
  other vias: 78.74,3.81
N$14
  Bottom 0.254: U304.2 37.53,32.92 R306.1
N$15
  Bottom 0.254: R302.2 50.04,16 51.73,17.69 U306.3
N$16
  Bottom 0.254: U306.1 57.29,16.14 57.24,16.14 R303.2
N$17
  Bottom 0.254: U304.3 38.15,33.57 37.34,34.38 37.34,35.14 R307.1
N$18
  Bottom 0.254: U306.4 55.88,19.5 U307.2
N$19
  Top 1.27: R104.1 11.02,8.41 C103.1
N$20
  Bottom 0.254: U304.6 39.66,35.52 38.27,36.92 R308.1
N$21
  Bottom 0.254: U304.5 39.05,34.87 37.08,36.83 37.08,39.37 38.1,40.39 39.79,40.39 R309.1
N$22
  Top 0.254: U204.27 33.17,26.15 R216.2
N$23
  Top 0.254: U204.28 34.96,25.65 R217.2
N$24
  Top 0.254: U204.29 36.75,25.15 R219.2
N$25
  Top 0.254: U204.30 37.35,24.65 37.08,24.38 R220.2
N$26
  Top 0.254: 51.05,22.01 R203.1 | 51.05,22.01 R204.1 | R205.2 51.05,19.81 51.05,22.01
N$27
  Top 1.27: R105.1 36.93,5.36 C106.1
N$28
  Bottom 1.27: C301.1 60.73,31.12 R301.1
N$29
  Top 0.254: R216.1 R217.1 32.68,21.34 R218.2
N$30
  Top 0.254: R219.1 R220.1 37.68,20.91 R221.2
N$31  (via drill 0.3 pad 0.51)
  Top 0.254: v44.96,35.31 44.96,37.66 R310.1
  Bottom 0.254: U304.10 45.31,36.17 44.96,35.81 v44.96,35.31
N$32
  Top 1.27: R202.1 27.41,39.01 C210.1
N$33  (via drill 0.3 pad 0.51)
  Top 0.254: R311.1 48.86,36.84 v47.55,35.52
  Bottom 0.254: U304.11 v47.55,35.52
N$35  (via drill 0.3 pad 0.51)
  Top 0.254: v44.96,34.29 45.89,34.29 R312.1
  Bottom 0.254: U304.14 45.68,33.57 v44.96,34.29
N$37  (via drill 0.3 pad 0.51)
  Top 0.254: v47.75,33.78 47.75,34.54 51.31,38.1 51.31,38.77 R313.1
  Bottom 0.254: 47.68,33.71 v47.75,33.78 47.31,34.22 U304.13
N$39
  Bottom 0.254: U305.4 59.24,32.99 R304.1
N$41
  Bottom 0.254: U305.3 57.08,36.6 R305.1
PREREG
  Top 0.61: 5.84,27.11 4.06,27.11 4.06,27.69 | 5.84,27.11 U301.1 | U301.3 5.84,25.21 5.84,27.11
  pour Top (isolate 0.254, no thermals): 7.11,39.88 3.56,39.88 3.56,30.23 8.13,30.23 8.13,28.19 6.86,28.19 6.86,26.67 0,26.67 0,41.91 7.11,41.91

### Text on the board
tPlace: CLK0 | 22.5792 MHz | Diff. Clock Generator | M. Price | CLK1 | 24.576 MHz